# EAGLE design 5portHub (EAGLE 9.4.2)
Assembly variants: jklhjkh
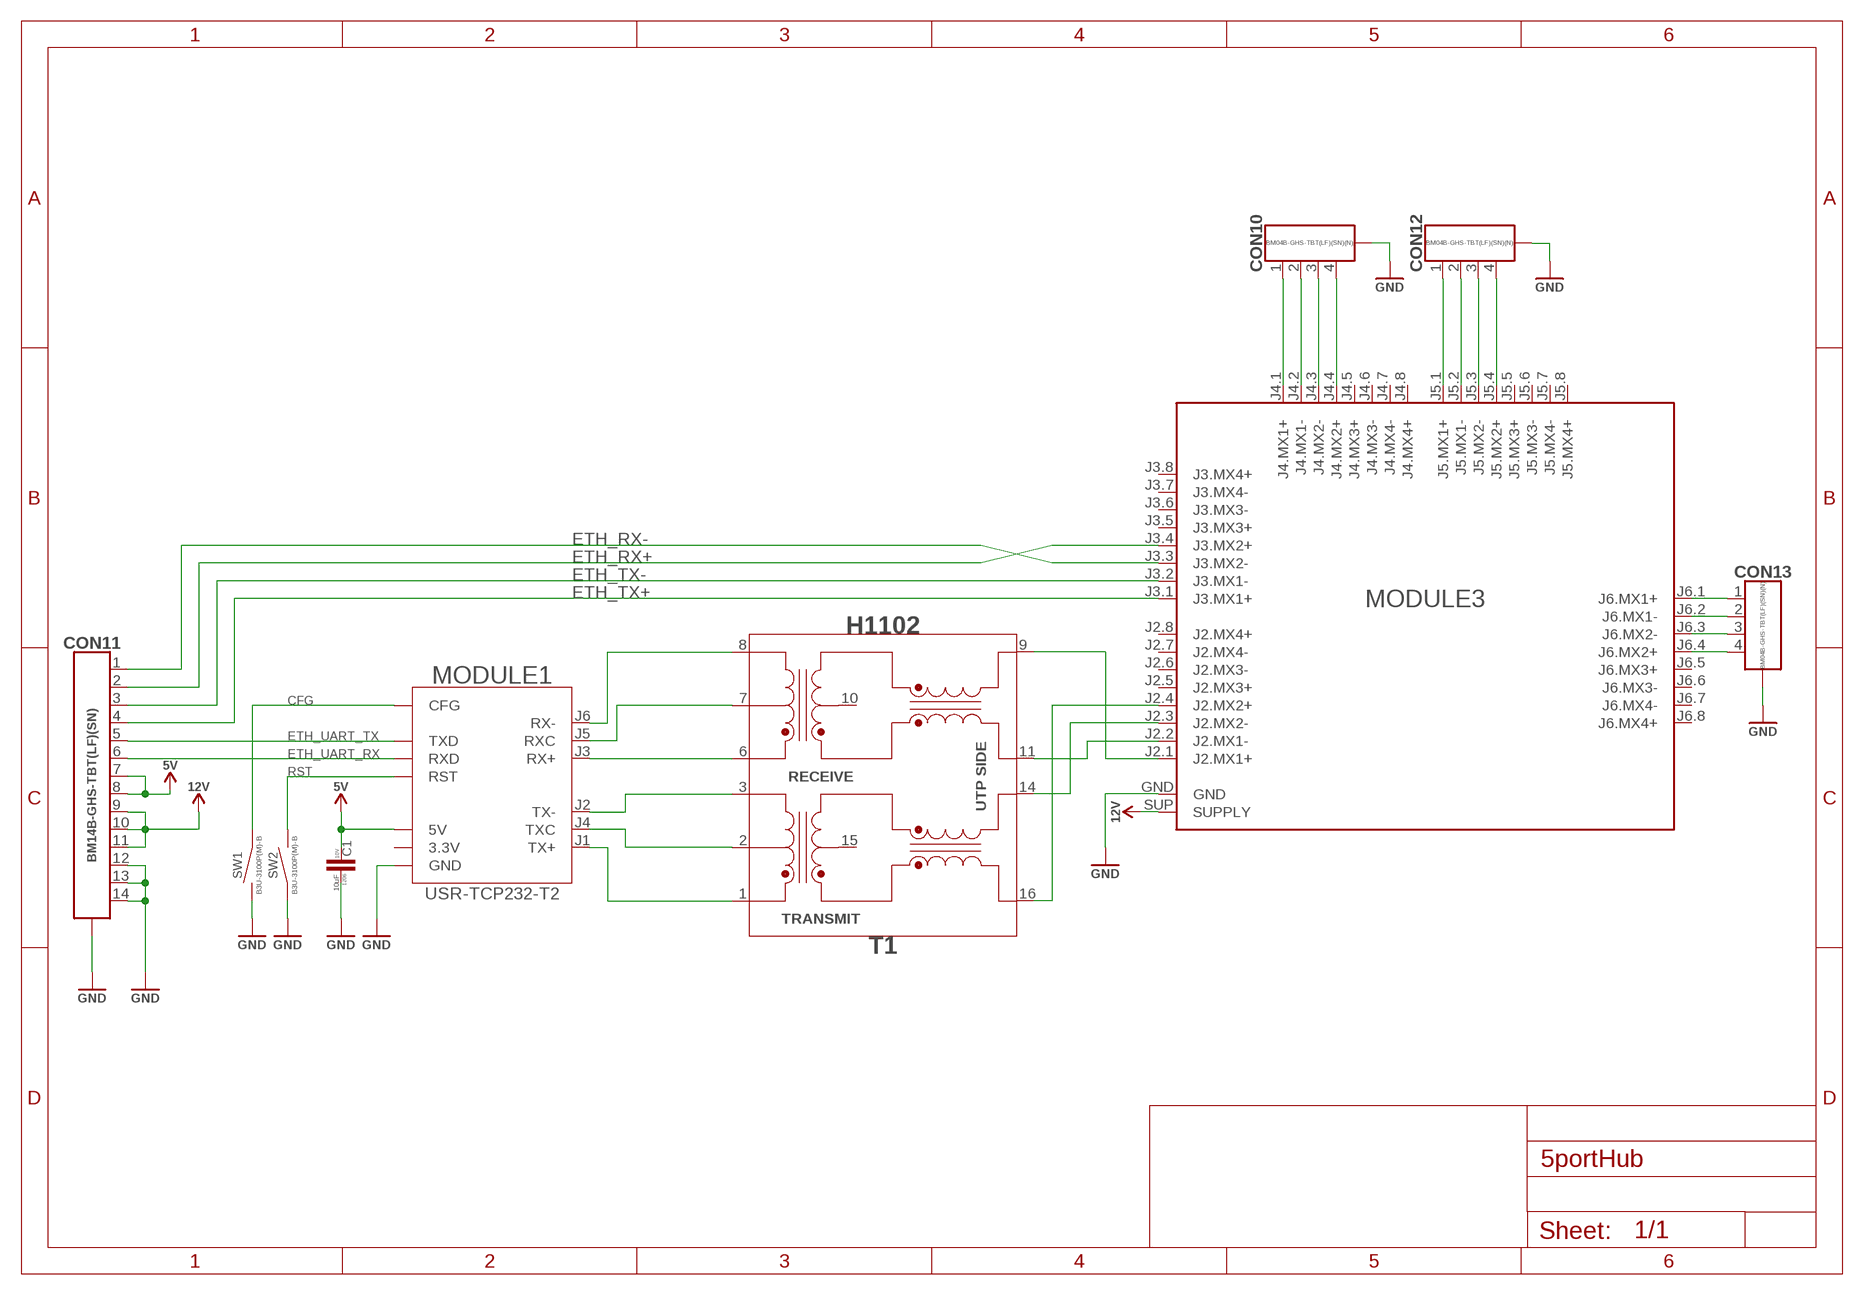
[diagram p0: schematic, sheet 1]

## Parts
C1  10uF  C-1206  [C1206]
CON10  CON-4P-TABS-JST-GH-TOP  [BM04B-GHS-TB]
CON11  CON-14P-TABS-JST-GH-TOP  [BM14B-GHS-TBT]
CON12  CON-4P-TABS-JST-GH-TOP  [BM04B-GHS-TB]
CON13  CON-4P-TABS-JST-GH-TOP  [BM04B-GHS-TB]
MODULE1  USR-TCP232-T2  [USR-TCP232-T2]
MODULE3  ANDDEAR_5PORT3  [ANDDEAR_5PORT3]
SW1  TACT_SWITCH-B3U-3100P(M)-B  [B3U-3100P(M)-B]
SW2  TACT_SWITCH-B3U-3100P(M)-B  [B3U-3100P(M)-B]
T1  H1102NL  [H1102]

## Nets
CFG: MODULE1.CFG SW1.P$1
ETH_RX+: CON11.2 MODULE3.J3.4(J3.MX2+)
ETH_RX-: CON11.1 MODULE3.J3.3(J3.MX2-)
ETH_TX+: CON11.4 MODULE3.J3.1(J3.MX1+)
ETH_TX-: CON11.3 MODULE3.J3.2(J3.MX1-)
ETH_UART_RX: CON11.6 MODULE1.RXD
ETH_UART_TX: CON11.5 MODULE1.TXD
GND: C1.P$1 CON10.M$0(GND) CON10.M$1(GND) CON11.12 CON11.13 CON11.14 CON11.M$0(G1) CON11.M$1(G1) CON12.M$0(GND) CON12.M$1(GND) CON13.M$0(GND) CON13.M$1(GND) MODULE1.GND MODULE3.GND SW1.P$2 SW2.P$1
N$5: CON13.1 MODULE3.J6.1(J6.MX1+)
N$6: CON13.2 MODULE3.J6.2(J6.MX1-)
N$7: CON13.3 MODULE3.J6.3(J6.MX2-)
N$8: CON13.4 MODULE3.J6.4(J6.MX2+)
N$9: MODULE3.J2.1(J2.MX1+) T1.9
N$10: MODULE3.J2.2(J2.MX1-) T1.11
N$11: MODULE3.J2.3(J2.MX2-) T1.14
N$12: MODULE3.J2.4(J2.MX2+) T1.16
N$13: MODULE1.J6(RX-) T1.8
N$14: MODULE1.J1(TX+) T1.1
N$15: MODULE1.J2(TX-) T1.3
N$16: MODULE1.J3(RX+) T1.6
N$21: CON12.1 MODULE3.J5.1(J5.MX1+)
N$22: CON12.2 MODULE3.J5.2(J5.MX1-)
N$23: CON12.3 MODULE3.J5.3(J5.MX2-)
N$24: CON12.4 MODULE3.J5.4(J5.MX2+)
N$25: CON10.1 MODULE3.J4.1(J4.MX1+)
N$26: CON10.2 MODULE3.J4.2(J4.MX1-)
N$27: CON10.3 MODULE3.J4.3(J4.MX2-)
N$28: CON10.4 MODULE3.J4.4(J4.MX2+)
N$37: MODULE1.J5(RXC) T1.7
N$38: MODULE1.J4(TXC) T1.2
RST: MODULE1.RST SW2.P$2
VDD_5V: C1.P$2 CON11.7 CON11.8 MODULE1.5V ; supply symbol labelled 5V
VDD_12V: CON11.9 CON11.10 CON11.11 MODULE3.SUP(SUPPLY) ; supply symbol labelled 12V
Unconnected: MODULE1.3.3V MODULE3.J2.5(J2.MX3+) MODULE3.J2.6(J2.MX3-) MODULE3.J2.7(J2.MX4-) MODULE3.J2.8(J2.MX4+) MODULE3.J3.5(J3.MX3+) MODULE3.J3.6(J3.MX3-) MODULE3.J3.7(J3.MX4-) MODULE3.J3.8(J3.MX4+) MODULE3.J4.5(J4.MX3+) MODULE3.J4.6(J4.MX3-) MODULE3.J4.7(J4.MX4-) MODULE3.J4.8(J4.MX4+) MODULE3.J5.5(J5.MX3+) MODULE3.J5.6(J5.MX3-) MODULE3.J5.7(J5.MX4-) MODULE3.J5.8(J5.MX4+) MODULE3.J6.5(J6.MX3+) MODULE3.J6.6(J6.MX3-) MODULE3.J6.7(J6.MX4-) MODULE3.J6.8(J6.MX4+) T1.10 T1.15

## Library data of the parts
C1 = rc:C; PACKAGE: 1206; VOLTAGE: 10V
CON10 CON12 CON13 = Connectors:CON-4P-TABS: Connector Receptacle 4 Position; DIGIKEY#: 455-1580-2-ND; ENTRY: TOP; LCSC#: C161692; MANF: JST Sales America Inc; MANF#: BM04B-GHS-TBT(LF)(SN)(N); OPERATING_TEMP: -25°C ~ 85°C
CON11 = Connectors:CON-14P-TABS; ENTRY: TOP; LCSC#: C265384; MANF: JST Sales America; MANF#: BM14B-GHS-TBT(LF)(SN)
MODULE1 = ali_modules:USR-TCP232-T2: Ethernet to UART converter; MANF: Waveshare; MANF#: USR-TCP232-T2
MODULE3 = ali_modules:ANDDEAR_5PORT3
SW1 SW2 = mechanical:TACT_SWITCH: tact switch; MANF: OMRON; MANF#: B3U-3100P(M)-B
T1 = misc:H1102NL: MODULE XFRMR SGL ETHR LAN 16SOIC; DIGIKEY#: 553-1203-ND; MANF: Pulse Electronics Corporation; MANF#: H1102

## Board
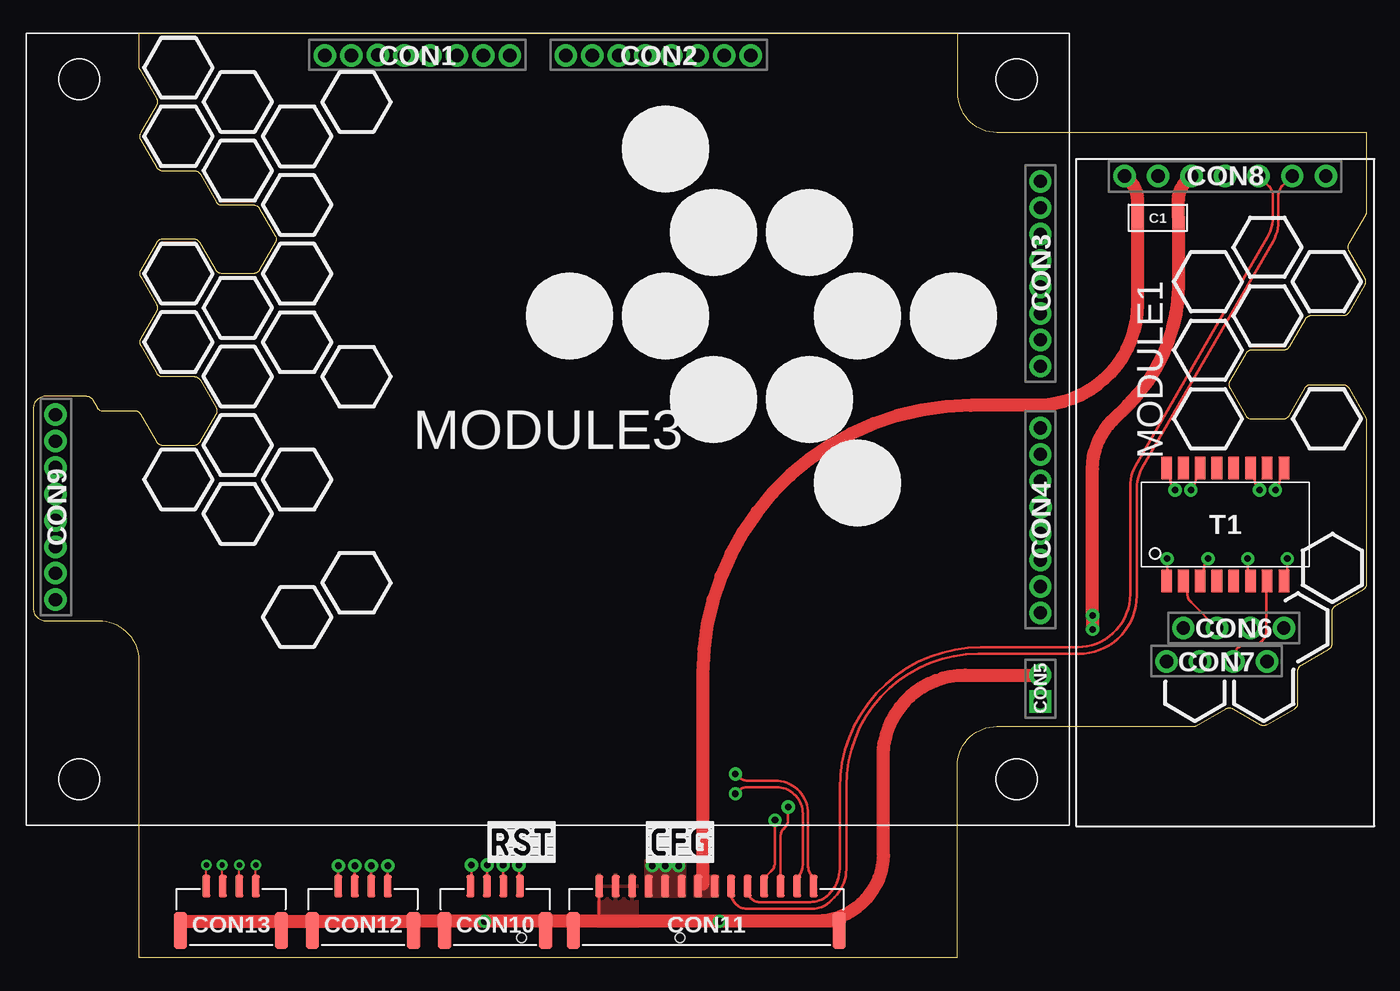
[diagram p1: board, top side]
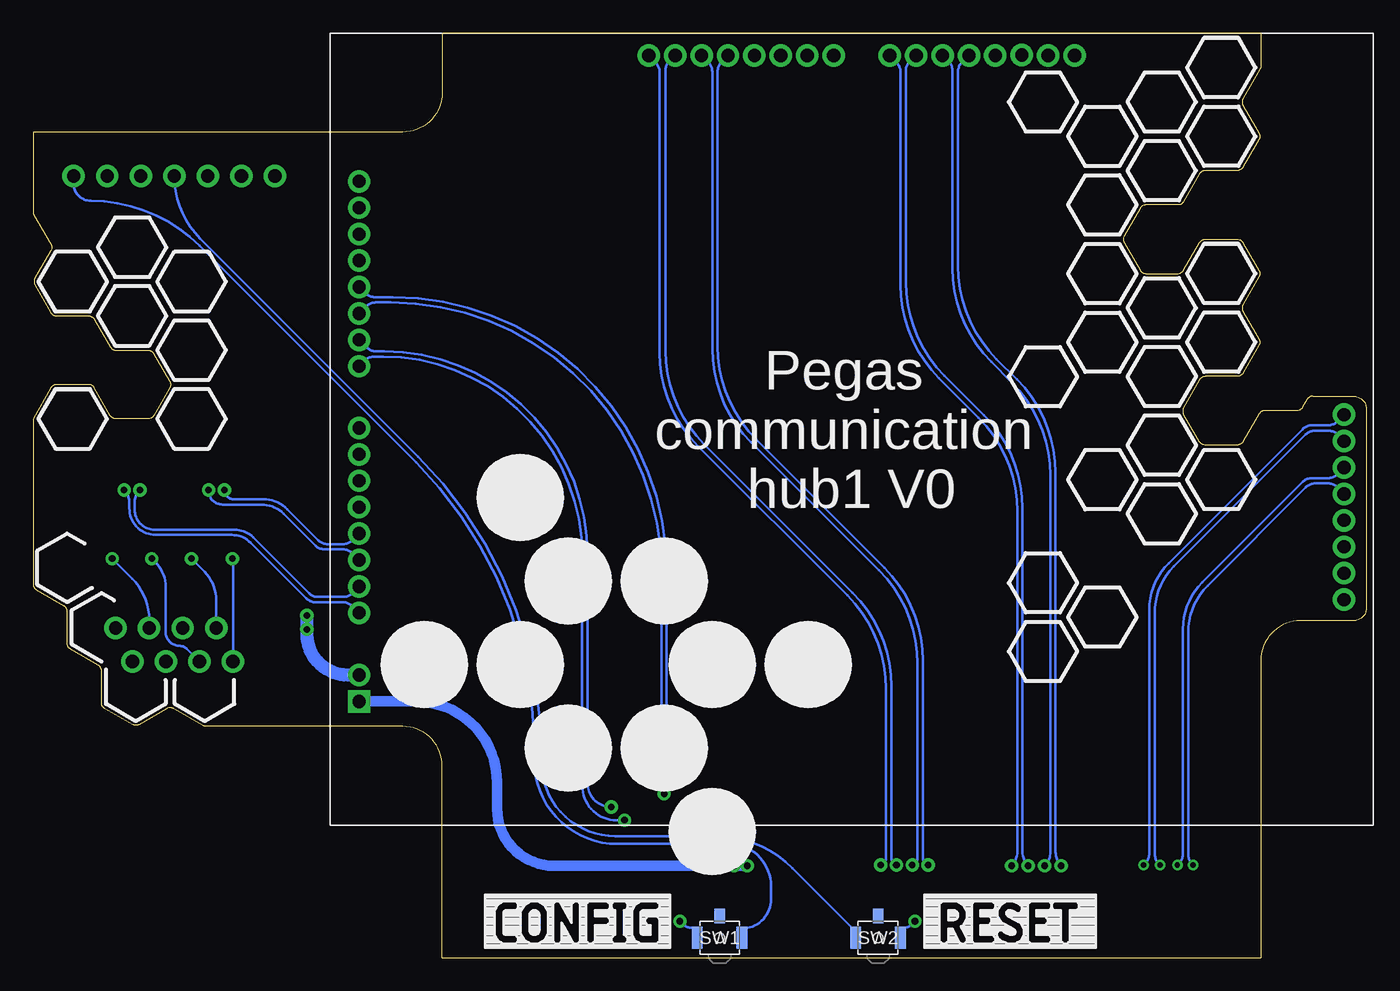
[diagram p2: board, bottom side, seen from below]

Size 101 x 70 mm. Coordinates in mm from the lower left corner, seen from the top.
Outline: 8,70 8,67.51 arc30 8.07,67.26 9.36,65.03 arc-60 9.36,64.53 8.14,62.43 arc60 8.14,61.93 9.36,59.83 arc60 9.79,59.58 12.21,59.58 arc-60 12.64,59.33 13.86,57.23 arc60 14.29,56.98 16.71,56.98 arc-60 17.14,56.73 18.36,54.64 arc-60 18.36,54.14 17.14,52.04 arc-60 16.71,51.79 14.29,51.79 arc-60 13.86,52.04 12.64,54.14 arc60 12.21,54.39 9.79,54.39 arc60 9.36,54.14 8.14,52.04 arc60 8.14,51.54 9.36,49.44 arc-60 9.36,48.94 8.14,46.84 arc60 8.14,46.34 9.36,44.24 arc60 9.79,43.99 12.21,43.99 arc-60 12.64,43.74 13.86,41.65 arc-60 13.86,41.15 12.64,39.05 arc-60 12.21,38.8 9.79,38.8 arc-60 9.36,39.05 8.14,41.15 arc60 7.71,41.4 5.29,41.4 arc-60 4.86,41.65 4.5,42.25 arc60 4.07,42.5 1,42.5 arc90 0,41.5 0,26.5 arc90 1,25.5 5,25.5 arc-90 8,22.5 8,0 70,0 70,14.5 arc-90 73,17.5 87.88,17.5 arc30 88.13,17.57 90.36,18.86 arc-60 90.86,18.86 92.96,17.64 arc60 93.46,17.64 95.56,18.86 arc60 95.81,19.29 95.81,21.71 arc-60 96.06,22.14 98.16,23.36 arc60 98.41,23.79 98.41,26.21 arc-60 98.66,26.64 100.75,27.86 arc60 101,28.29 101,40.79 99.64,43.14 arc60 99.21,43.39 96.79,43.39 arc60 96.36,43.14 95.14,41.04 arc-60 94.71,40.79 92.29,40.79 arc-60 91.86,41.04 90.64,43.14 arc-60 90.64,43.64 91.86,45.73 arc-60 92.29,45.98 94.71,45.98 arc60 95.14,46.23 96.36,48.33 arc-60 96.79,48.58 99.21,48.58 arc60 99.64,48.83 100.86,50.93 arc60 100.86,51.43 99.64,53.53 arc-60 99.64,54.03 100.93,56.26 arc30 101,56.51 101,62.5 73,62.5 arc-90 70,65.5 70,70 8,70
Copper layers (1*16): Top 0.035mm / dielectric 1.5mm / Bottom 0.035mm
Design rules "JLCPCB 2 layer *": minimum track width 6mil, minimum drill 0.3mm, track to track 0.15mm, track to pad 0.15mm, pad to pad 0.15mm, via to via 0.15mm, smd to smd 0.1mm, copper to edge 0.2mm, drill to drill 6mil, minimum pad ring 0.15mm, minimum via ring 0.15mm, stop-mask expansion 0.05mm, vias tented up to drill 0.5mm, thermal gap 10mil

### Footprints (pad centres in the part's own frame; a part is rotated, then mirrored left to right if it is on the bottom)
C1206 = smd 0.9 x 1.6: P$1 -1.55,0; P$2 1.55,0
BM04B-GHS-TB = smd 0.6 x 1.7: 1 -1.875,-2.9; 2 -0.625,-2.9; 3 0.625,-2.9; 4 1.875,-2.9 | smd 1 x 2.8: M$0 -3.825,0.45; M$1 3.825,0.45
BM14B-GHS-TBT = smd 0.6 x 1.7: 1 -8.125,-2.9; 2 -6.875,-2.9; 3 -5.625,-2.9; 4 -4.375,-2.9; 5 -3.125,-2.9; 6 -1.875,-2.9; 7 -0.625,-2.9; 8 0.625,-2.9; 9 1.875,-2.9; 10 3.125,-2.9; 11 4.375,-2.9; 12 5.625,-2.9; 13 6.875,-2.9; 14 8.125,-2.9 | smd 1 x 2.8: M$0 -10.075,0.45; M$1 10.075,0.45
USR-TCP232-T2 = drill 1 pad 1.7: 3.3V -23.98,-5.08; 5V -23.98,-7.62; CFG -23.98,7.62; GND -23.98,-2.54; J1 12.79,-4.445; J2 10.25,-3.175; J3 12.79,-1.905; J4 10.25,-0.635; J5 12.79,0.635; J6 10.25,1.905; J7 12.79,3.175; J8 10.25,4.445; RST -23.98,0; RXD -23.98,5.08; TXD -23.98,2.54
ANDDEAR_5PORT3 = drill 1 pad 1.7: GND 37.3,-18.61; J2.1 37.3,-13.9; J2.2 37.3,-11.9; J2.3 37.3,-9.9; J2.4 37.3,-7.9; J2.5 37.31,-5.9; J2.6 37.3,-3.9; J2.7 37.3,-1.9; J2.8 37.3,0.1; J3.1 37.3,4.77; J3.2 37.3,6.77; J3.3 37.3,8.77; J3.4 37.3,10.77; J3.5 37.3,12.77; J3.6 37.3,14.77; J3.7 37.3,16.77; J3.8 37.3,18.77; J4.1 15.36,28.3; J4.2 13.36,28.3; J4.3 11.36,28.3; J4.4 9.36,28.3; J4.5 7.36,28.3; J4.6 5.36,28.3; J4.7 3.36,28.3; J4.8 1.36,28.3; J5.1 -2.89,28.3; J5.2 -4.89,28.3; J5.3 -6.89,28.3; J5.4 -8.89,28.3; J5.5 -10.89,28.3; J5.6 -12.89,28.33; J5.7 -14.89,28.3; J5.8 -16.89,28.3; J6.1 -37.3,1.1; J6.2 -37.3,-0.9; J6.3 -37.3,-2.9; J6.4 -37.3,-4.9; J6.5 -37.3,-6.9; J6.6 -37.3,-8.9; J6.7 -37.3,-10.9; J6.8 -37.3,-12.9 | drill 1 pad 1.7 square: SUP 37.3,-20.61
B3U-3100P(M)-B = smd 0.8 x 1.7: P$1 -1.7,0; P$2 1.7,0 | smd 0.8 x 1.1: P$3 0,-1.65 | hole 0.75: 0,0
H1102 = smd 0.8 x 1.7: 1 -4.445,-4.28; 2 -3.175,-4.28; 3 -1.905,-4.28; 4 -0.635,-4.28; 5 0.635,-4.28; 6 1.905,-4.28; 7 3.175,-4.28; 8 4.445,-4.28; 9 4.445,4.28; 10 3.175,4.28; 11 1.905,4.28; 12 0.635,4.28; 13 -0.635,4.28; 14 -1.905,4.28; 15 -3.175,4.28; 16 -4.445,4.28

### Placement (x,y rotation side)
C1  85.2,56 180 top
CON10  35,2.5 180 top
CON11  51,2.5 180 top
CON12  25,2.5 180 top
CON13  15,2.5 180 top
MODULE1  90.3,35.2 270 top
MODULE3  39,40 0 top
SW1  49,1.5 180 bottom
SW2  37,1.5 180 bottom
T1  90.3,32.8 0 top
U$1  [AERODYNE]  55.2,48.6 0 top
U$2  [AERODYNE]  56.8,22.2 0 bottom

### Tracks (layer width: path | path; a pad name or v marks a point on that pad's centre or on a via)
CFG
  Bottom 0.2: MODULE1.CFG 97.92,58.58 arc-90 96.64,57.3 arc45 88.38,53.88 72,37.5 arc45 63.03,15.85 63.03,14.9 arc-90 56.73,8.6 48.3,8.6 arc90 45.1,5.4 45.1,4.4 arc90 47.3,2.2 SW1.P$1
ETH_RX+  (via drill 0.5 pad 1)
  Top 0.2: v53.2,12.4 53.41,12.61 arc-45 54.11,12.9 56.3,12.9 arc-90 58.3,10.9 58.3,7.02 arc-45 57.88,5.99 CON11.2
  Bottom 0.2: v53.2,12.4 arc45 53.06,12.74 52.61,13.19 arc-90 52.61,14.61 arc45 53,15.56 53,29.25 arc-90 73.75,50 75.12,50 arc45 75.82,50.29 MODULE3.J3.4
ETH_RX-  (via drill 0.5 pad 1)
  Top 0.2: v53.2,13.9 53.41,13.69 arc45 54.11,13.4 56.2,13.4 arc-90 58.7,10.9 58.7,7.02 arc45 59.12,5.99 CON11.1
  Bottom 0.2: v53.2,13.9 arc45 53.4,14.38 53.4,29.1 arc-90 73.9,49.6 75.06,49.6 arc-45 75.76,49.31 MODULE3.J3.3
ETH_TX+  (via drill 0.5 pad 1)
  Top 0.2: v56.2,10.4 56.2,7.24 arc-45 55.91,6.53 55.38,6 CON11.4
  Bottom 0.2: v56.2,10.4 56.8,10.4 arc90 59.4,13 59.4,30.4 arc-90 74.5,45.5 75.16,45.5 arc-45 75.86,45.21 MODULE3.J3.1
ETH_TX-  (via drill 0.5 pad 1)
  Top 0.2: v57.2,11.4 57.2,10.51 arc-45 56.91,9.81 56.89,9.79 arc45 56.6,9.09 56.6,5.42 CON11.3
  Bottom 0.2: v57.2,11.4 arc90 59,13.2 59,30.5 arc-90 74.4,45.9 75.02,45.9 arc45 75.72,46.19 MODULE3.J3.2
ETH_UART_RX
  Top 0.2: CON11.6 52.88,4.9 arc90 54.08,3.7 59.02,3.7 arc45 60.44,4.29 60.72,4.57 arc45 61.6,6.69 61.6,13 arc-90 71.6,23 79.2,23 arc90 83.6,27.4 83.6,35.55 arc-30 84,37.05 93.93,54.25 arc30 94.33,55.75 94.33,57.72 arc-45 94.62,58.42 MODULE1.RXD
ETH_UART_TX
  Top 0.2: CON11.5 54.12,5.1 arc90 55.02,4.2 58.87,4.2 arc45 60.29,4.79 arc45 61.1,6.75 61.1,12.8 arc-90 71.8,23.5 79.1,23.5 arc90 83.1,27.5 83.1,35.7 arc-30 83.5,37.2 93.5,54.53 arc30 93.9,56.03 93.9,57.71 arc45 93.61,58.41 MODULE1.TXD
GND  (via drill 0.5 pad 1)
  Top 0.2: CON11.14 42.88,2.83 42.8,2.75 | CON10.M$1 31.18,2.62 31.3,2.75 | CON12.M$0 28.82,2.67 28.9,2.75 | CON11.M$0 61.08,2.73 61.1,2.75 | CON11.M$1 40.9,2.08 40.9,2.75 | CON12.M$1 21.18,2.73 21.2,2.75 | CON10.M$0 38.8,2.08 38.8,2.75
  Top 1: MODULE1.GND 87.34,58.76 arc45 86.75,57.34 C1.P$1 86.75,51.06 arc-45 82.92,41.82 81.76,40.66 arc45 80.25,37.01 v80.25,25.9 v80.25,24.85 | 59.3,2.75 arc90 64.4,7.85 64.4,15.19 arc-90 70.6,21.39 MODULE3.GND | 61.1,2.75 59.3,2.75 | 59.3,2.75 v52,2.75 42.8,2.75 40.9,2.75 38.8,2.75 v34.2,2.75 31.3,2.75 28.9,2.75 21.2,2.75 18.82,2.75 | CON13.M$0 18.82,2.75 | CON13.M$1 11.18,2.75 18.82,2.75
  Bottom 0.2: SW1.P$2 50.7,2.2 50.75,2.25 51.09,2.25 arc45 51.79,2.54 v52,2.75 | v34.2,2.75 34.41,2.54 arc45 35.11,2.25 35.3,2.25 SW2.P$1
  Bottom 1: MODULE3.GND 77.15,21.39 arc90 80.25,24.49 v80.25,25.9
  pour Top: 42.8,6.3 45.8,6.3 45.8,2.35 42.8,2.35
N$5  (via drill 0.4 pad 0.8)
  Top 0.152: CON13.1 v16.88,7
  Bottom 0.2: v16.88,7 16.78,7.09 arc-45 16.45,7.89 16.45,26.33 arc45 14.99,29.86 4.84,40.01 arc45 4.14,40.3 2.91,40.3 arc-45 2.21,40.59 MODULE3.J6.1
N$6  (via drill 0.4 pad 0.8)
  Top 0.152: CON13.2 v15.62,7
  Bottom 0.2: v15.62,7 15.72,7.1 arc45 16.05,7.89 16.05,26.08 arc45 14.59,29.61 4.59,39.61 arc45 3.89,39.9 2.91,39.9 arc45 2.21,39.61 MODULE3.J6.2
N$7  (via drill 0.4 pad 0.8)
  Top 0.152: CON13.3 14.32,5.45 v14.32,7
  Bottom 0.152: v14.32,7 14.32,7.03
  Bottom 0.2: MODULE3.J6.3 2.21,36.59 arc45 2.91,36.3 4.14,36.3 arc-45 4.84,36.01 12.44,28.41 arc-45 13.9,24.88 13.9,7.86 arc45 14.19,7.16 14.32,7.03
N$8  (via drill 0.4 pad 0.8)
  Top 0.152: CON13.4 v13.12,7
  Bottom 0.152: v13.12,7 13.12,7.03
  Bottom 0.2: MODULE3.J6.4 2.21,35.61 arc-45 2.91,35.9 3.89,35.9 arc-45 4.59,35.61 12.04,28.16 arc-45 13.5,24.63 13.5,7.81 arc-45 13.21,7.11 13.12,7.03
N$9  (via drill 0.5 pad 1)
  Top 0.2: T1.9 94.44,36.78 94.44,36.23 arc-45 v94.1,35.4
  Bottom 0.2: v94.1,35.4 arc45 93.7,34.43 93.7,34 arc-90 91.7,32 85.94,32 arc45 84.52,31.41 80.3,27.19 arc-45 79.6,26.9 77.51,26.9 arc45 76.81,26.61 MODULE3.J2.1
N$10  (via drill 0.5 pad 1)
  Top 0.2: T1.11 92.5,36.78 92.5,36.35 arc45 v92.9,35.4
  Bottom 0.2: v92.9,35.4 arc-45 93.3,34.43 93.3,33.9 arc-90 91.8,32.4 85.74,32.4 arc45 84.32,31.81 80.1,27.59 arc-45 79.4,27.3 77.51,27.3 arc-45 76.81,27.59 MODULE3.J2.2
N$11  (via drill 0.5 pad 1)
  Top 0.2: T1.14 88.09,36.78 88.09,36.35 arc-45 v87.7,35.4
  Bottom 0.2: v87.7,35.4 87.7,35.35 arc-90 86.65,34.3 83.71,34.3 arc45 82,33.59 79.6,31.19 arc-45 78.9,30.9 77.51,30.9 arc45 76.81,30.61 MODULE3.J2.3
N$12  (via drill 0.5 pad 1)
  Top 0.2: T1.16 86.16,36.78 86.16,36.23 arc45 v86.5,35.4
  Bottom 0.2: v86.5,35.4 arc-90 85.8,34.7 83.57,34.7 arc45 81.74,33.94 79.39,31.59 arc-45 78.69,31.3 77.51,31.3 arc-45 76.81,31.59 MODULE3.J2.4
N$13  (via drill 0.5 pad 1)
  Top 0.2: v95,30.2 95,28.77 T1.8
  Bottom 0.2: v95,30.2 93.49,28.69 arc45 92.2,25.58 MODULE1.J6
N$14  (via drill 0.5 pad 1)
  Top 0.2: v85.9,30.2 85.9,28.57 T1.1
  Bottom 0.2: v85.9,30.2 85.85,30.16 MODULE1.J1
N$15  (via drill 0.5 pad 1)
  Top 0.2: v89,30.2 88.99,30.19 arc45 88.69,29.48 88.69,28.82 T1.3
  Bottom 0.2: MODULE1.J2 87.12,27.07 arc-45 88.01,29.21 v89,30.2
N$16  (via drill 0.5 pad 1)
  Top 0.2: v92,30.2 92,28.72 T1.6
  Bottom 0.2: MODULE1.J3 89.36,23.37 arc-45 89.91,23.6 arc90 90.95,24.64 90.95,28.05 arc-45 91.73,29.93 v92,30.2
N$21  (via drill 0.5 pad 1)
  Top 0.2: CON12.1 v26.88,6.95
  Bottom 0.2: v26.88,6.95 arc-45 26.45,7.98 26.45,33.81 arc-45 29.38,40.88 32.37,43.87 arc45 35.3,50.94 35.3,67.08 arc-45 35.59,67.78 MODULE3.J5.1
N$22  (via drill 0.5 pad 1)
  Top 0.2: CON12.2 v25.62,6.95
  Bottom 0.2: v25.62,6.95 arc45 26.05,7.98 26.05,34 arc-45 28.98,41.07 31.97,44.06 arc45 34.9,51.13 34.9,67.1 arc45 34.61,67.8 MODULE3.J5.2
N$23  (via drill 0.5 pad 1)
  Top 0.2: CON12.3 v24.38,6.95
  Bottom 0.2: v24.38,6.95 arc-45 23.95,7.98 23.95,36.5 arc-45 26.88,43.57 28.42,45.12 arc45 31.35,52.19 31.35,67.13 arc-45 31.64,67.83 MODULE3.J5.3
N$24  (via drill 0.5 pad 1)
  Top 0.2: CON12.4 v23.12,6.95
  Bottom 0.2: v23.12,6.95 arc45 23.55,7.98 23.55,36.7 arc-45 26.48,43.77 28.02,45.31 arc45 30.95,52.38 30.95,67.05 arc45 30.66,67.75 MODULE3.J5.4
N$25  (via drill 0.5 pad 1)
  Top 0.2: v36.8,7 36.8,5.47 CON10.1
  Bottom 0.2: v36.8,7 36.4,7.4 36.4,20.36 arc-45 39.33,27.43 50.62,38.72 arc45 53.55,45.79 53.55,67.08 arc-45 53.84,67.78 MODULE3.J4.1
N$26  (via drill 0.5 pad 1)
  Top 0.2: v35.6,7 35.6,5.42 CON10.2
  Bottom 0.2: v35.6,7 36,7.4 36,20.56 arc-45 38.93,27.63 50.17,38.87 arc45 53.1,45.94 53.1,67.15 arc45 52.81,67.85 MODULE3.J4.2
N$27  (via drill 0.5 pad 1)
  Top 0.2: v34.4,7 34.4,5.42 CON10.3
  Bottom 0.2: v34.4,7 34,7.4 34,22.26 arc-45 36.93,29.33 46.62,39.02 arc45 49.55,46.09 49.55,67.08 arc-45 49.84,67.78 MODULE3.J4.3
N$28  (via drill 0.5 pad 1)
  Top 0.2: CON10.4 33.2,5.47 v33.2,7
  Bottom 0.2: v33.2,7 33.6,7.4 33.6,22.46 arc-45 36.53,29.53 46.22,39.22 arc45 49.15,46.29 49.15,67.1 arc45 48.86,67.8 MODULE3.J4.4
N$37
  Top 0.2: MODULE1.J5 90.94,22.7 arc-90 91.94,23.7 92.4,23.7 arc90 93.4,24.7 93.4,28.45 T1.7
N$38
  Top 0.2: MODULE1.J4 87.72,26.9 arc-45 87.42,27.6 87.42,28.22 T1.2
RST
  Bottom 0.2: MODULE1.RST arc-45 88.33,54.43 71.82,37.92 arc45 62.5,15.42 62.5,14.8 arc-90 56.9,9.2 49.34,9.2 arc45 43.47,6.77 38.7,2 SW2.P$2
VDD_5V
  Top 1: MODULE1.5V 83.06,58.8 arc-45 83.65,57.38 C1.P$2 83.65,49.5 arc-90 75.95,41.8 71.02,41.8 arc90 50.72,21.5 50.72,5.55
  pour Top (no thermals): 50.1,4.6 50.1,6.2 51.9,6.2 51.9,4.6
VDD_12V  (via drill 0.5 pad 1)
  Bottom 0.8: v46.9,6.95 v48.9,6.95 61.55,6.95 arc90 65.85,11.25 65.85,13.24 arc-90 72,19.39 MODULE3.SUP
  other vias: 47.9,6.95
  pour Top (no thermals): 46.4,4.6 46.4,7.35 49.4,7.35 49.4,4.6

### Text on the board
bPlace: Pegas / communication / hub1 V0
tNames: CON1 | CON2 | CON8 | CON3 | CON9 | CON4 | CON6 | CON7 | CON5